# EAGLE design ESP-01 Breadboard (EAGLE 6.5.0)
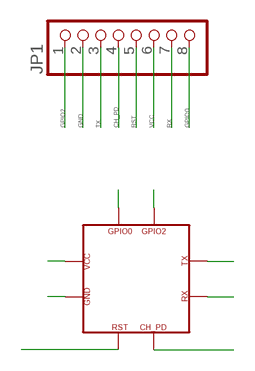
[diagram p0: schematic, sheet 1]

## Parts
JP1  PINHD-1X8/90  [1X08/90]
U$1  ESP-01  [ESP-01]

## Nets
CH_PD: JP1.4 U$1.CH_PD(CP_PD)
GND: JP1.2 U$1.GND
GPIO0: JP1.8 U$1.GPIO0
GPIO2: JP1.1 U$1.GPIO2
RST: JP1.5 U$1.RST
RX: JP1.7 U$1.RXD(RX)
TX: JP1.3 U$1.TXD(TX)
VCC: JP1.6 U$1.VCC

## Library data of the parts
JP1 = pinhead:PINHD-1X8: PIN HEADER
U$1 = Franc:ESP-01

## Board
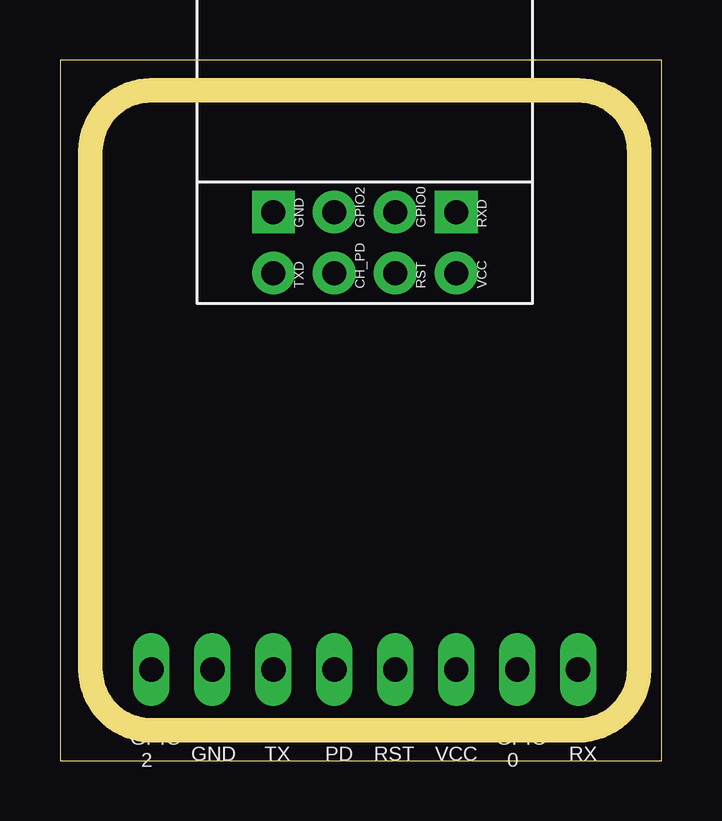
[diagram p1: board, top side]
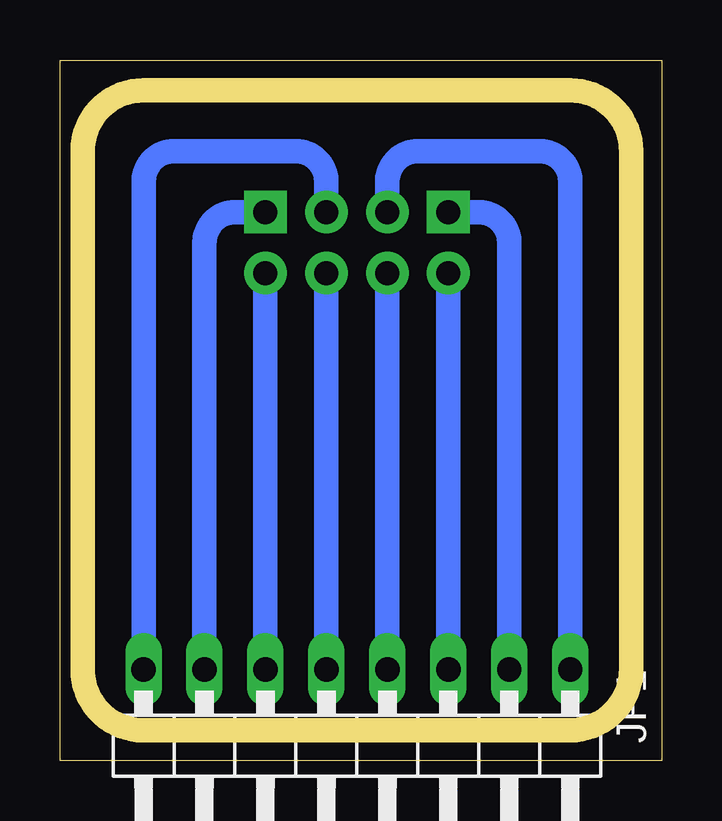
[diagram p2: board, bottom side, seen from below]

Size 25.07 x 29.2 mm. Coordinates in mm from the lower left corner, seen from the top.
Outline: 0,0 25.07,0 25.07,29.2 0,29.2 0,0
Copper layers (1*16): Top 0.035mm / dielectric 1.5mm / Bottom 0.035mm
Design rules "default": minimum track width 10mil, minimum drill 24mil, track to track 8mil, track to pad 8mil, pad to pad 8mil, via to via 8mil, smd to smd 8mil, copper to edge 40mil, drill to drill 8mil, minimum pad ring 10mil, minimum via ring 8mil, stop-mask expansion 4mil, vias tented up to drill 0mil, thermal gap 10mil
Milling: 8 lines

### Footprints (pad centres in the part's own frame; a part is rotated, then mirrored left to right if it is on the bottom)
1X08/90 = drill 1.016 long: 1 -8.89,-3.81; 2 -6.35,-3.81; 3 -3.81,-3.81; 4 -1.27,-3.81; 5 1.27,-3.81; 6 3.81,-3.81; 7 6.35,-3.81; 8 8.89,-3.81
ESP-01 = drill 1 pad 1.778: CH_PD -1.27,1.27; GPIO0 1.27,-1.27; GPIO2 1.27,1.27; RST -1.27,-1.27; TXD -1.27,3.81; VCC -1.27,-3.81 | drill 1 pad 1.778 square: GND 1.27,3.81; RXD 1.27,-3.81

### Placement (x,y rotation side)
JP1  12.7,0 180 bottom
U$1  12.7,21.59 90 top

### Tracks (layer width: path | path; a pad name or v marks a point on that pad's centre or on a via)
CH_PD
  Bottom 1.016: JP1.4 U$1.CH_PD
GND
  Bottom 1.016: JP1.2 6.35,21.59 arc-90 7.62,22.86 U$1.GND
GPIO0
  Bottom 1.016: JP1.8 21.59,24.13 arc90 20.32,25.4 15.24,25.4 arc90 13.97,24.13 U$1.GPIO0
GPIO2
  Bottom 1.016: JP1.1 3.81,24.13 arc-90 5.08,25.4 10.16,25.4 arc-90 11.43,24.13 U$1.GPIO2
RST
  Bottom 1.016: JP1.5 U$1.RST
RX
  Bottom 1.016: JP1.7 19.05,21.59 arc90 17.78,22.86 U$1.RXD
TX
  Bottom 1.016: JP1.3 U$1.TXD
VCC
  Bottom 1.016: JP1.6 U$1.VCC

### Text on the board
tNames: GPIO / 2 | GND | TX | CH / PD | RST | VCC | GPIO / 0 | RX